# Altium project Khach.PrjPcb
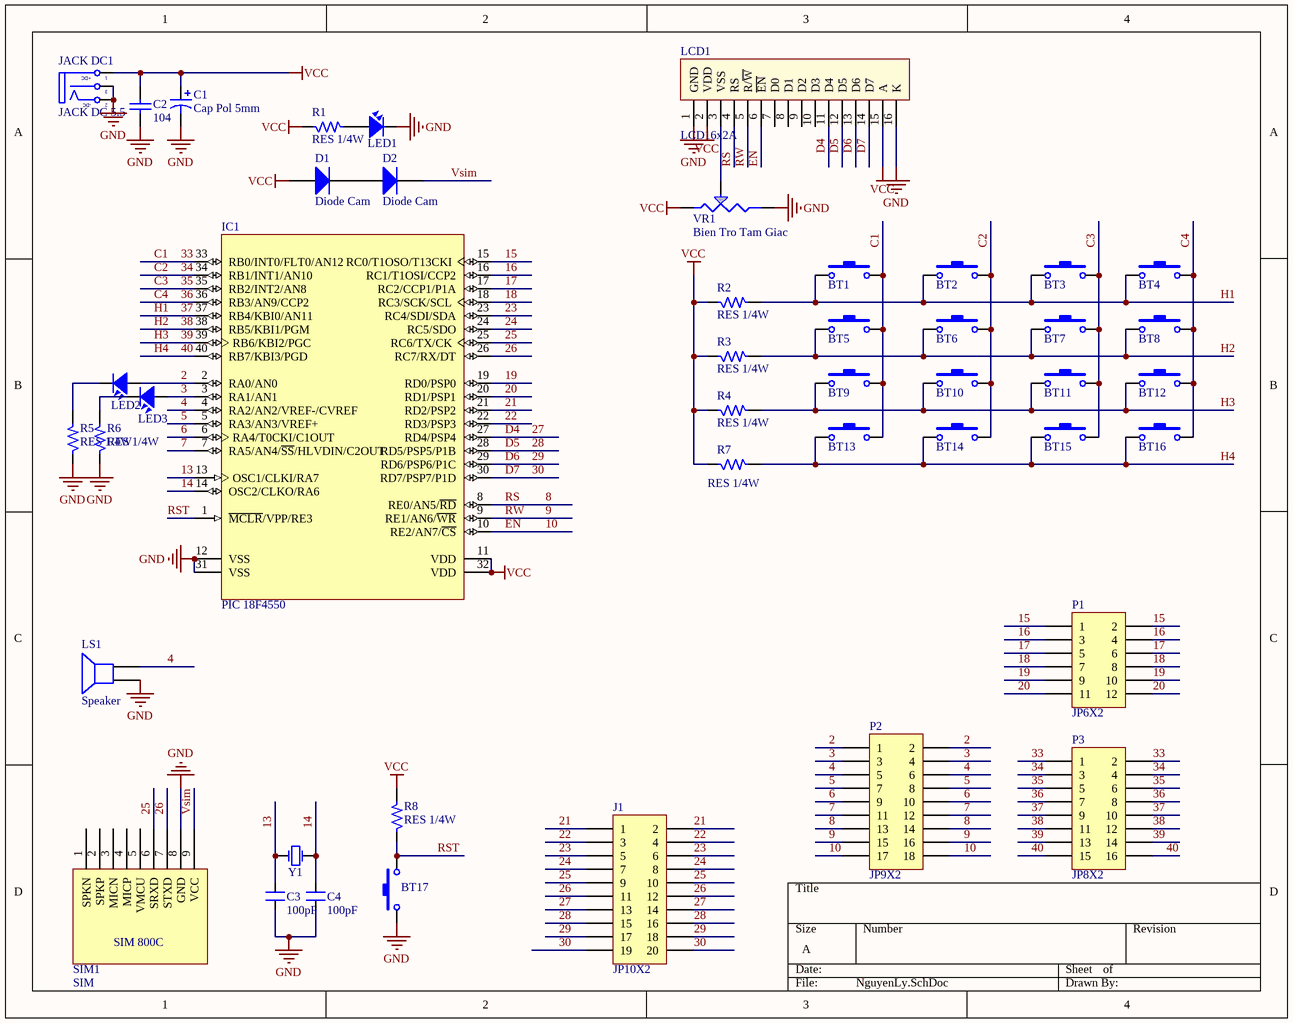
[diagram p0: NguyenLy.SchDoc]
1 sheet, 45 parts. Net scope: global (net labels, ports and power ports of the same name join across sheets).
Board file: PCB.PcbDoc

## Sheet NguyenLy.SchDoc
size A

### Parts
BT1  Nut Nhan 2 Chan  [Nut Nhan 2 Chan]  (value not drawn)
BT2  Nut Nhan 2 Chan  [Nut Nhan 2 Chan]  (value not drawn)
BT3  Nut Nhan 2 Chan  [Nut Nhan 2 Chan]  (value not drawn)
BT4  Nut Nhan 2 Chan  [Nut Nhan 2 Chan]  (value not drawn)
BT5  Nut Nhan 2 Chan  [Nut Nhan 2 Chan]  (value not drawn)
BT6  Nut Nhan 2 Chan  [Nut Nhan 2 Chan]  (value not drawn)
BT7  Nut Nhan 2 Chan  [Nut Nhan 2 Chan]  (value not drawn)
BT8  Nut Nhan 2 Chan  [Nut Nhan 2 Chan]  (value not drawn)
BT9  Nut Nhan 2 Chan  [Nut Nhan 2 Chan]  (value not drawn)
BT10  Nut Nhan 2 Chan  [Nut Nhan 2 Chan]  (value not drawn)
BT11  Nut Nhan 2 Chan  [Nut Nhan 2 Chan]  (value not drawn)
BT12  Nut Nhan 2 Chan  [Nut Nhan 2 Chan]  (value not drawn)
BT13  Nut Nhan 2 Chan  [Nut Nhan 2 Chan]  (value not drawn)
BT14  Nut Nhan 2 Chan  [Nut Nhan 2 Chan]  (value not drawn)
BT15  Nut Nhan 2 Chan  [Nut Nhan 2 Chan]  (value not drawn)
BT16  Nut Nhan 2 Chan  [Nut Nhan 2 Chan]  (value not drawn)
BT17  Nut Nhan 2 Chan  [Nut Nhan 2 Chan]  (value not drawn)
C1  Cap Pol 5mm  [C5mm]
C2  104  [Tu-ceramic]
C3  100pF  [CN1]
C4  100pF  [CN1]
D1  Diode Cam  [Diode Cam]
D2  Diode Cam  [Diode Cam]
IC1  PIC 18F4550  [DIP40/W0.6]
J1  JP10X2  [HDR2X10]
JACK_DC1  JACK DC 5.5  [JACK DC 5.5]
LCD1  LCD16x2A  [LCD16X2]
LED1  LED  [LED-3MM-YELLOW]  (value not drawn)
LED2  LED  [LED-3MM-YELLOW]  (value not drawn)
LED3  LED  [LED-3MM-YELLOW]  (value not drawn)
LS1  Speaker  [SPK]
P1  JP6X2  [HDR2X6]
P2  JP9X2  [HDR2X9]
P3  JP8X2  [HDR2X8]
R1  RES 1/4W  [Tro 1/4W]
R2  RES 1/4W  [Tro 1/4W]
R3  RES 1/4W  [Tro 1/4W]
R4  RES 1/4W  [Tro 1/4W]
R5  RES 1/4W  [Tro 1/4W]
R6  RES 1/4W  [Tro 1/4W]
R7  RES 1/4W  [Tro 1/4W]
R8  RES 1/4W  [Tro 1/4W]
SIM1  SIM  [JUMP DON 9]
VR1  Bien Tro Tam Giac  [VR-TAM GIAC]
Y1  20MHz  [Thach anh 2 chan]  (value not drawn)

### Nets
GND: BT17.1 C1.2 C2.1 C3.2 C4.2 IC1.12(VSS) IC1.31(VSS) JACK_DC1.2(TN) JACK_DC1.3(S) LCD1.1(GND) LCD1.16(K) LED1.2 LS1.1 R5.1 R6.1 SIM1.8(GND) VR1.3(B)
VCC: C1.1 C2.2 D1.1(A) IC1.11(VDD) IC1.32(VDD) JACK_DC1.1(T) LCD1.2(VDD) LCD1.15(A) R1.1 R2.1 R3.1 R4.1 R7.1 R8.2 VR1.1(A)
2: IC1.2(RA0/AN0) LED2.1 P2.1 P2.2
3: IC1.3(RA1/AN1) LED3.1 P2.3 P2.4
4: IC1.4(RA2/AN2/VREF-/CVREF) LS1.2 P2.5 P2.6
5: IC1.5(RA3/AN3/VREF+) P2.7 P2.8
6: IC1.6(RA4/T0CKI/C1OUT) P2.9 P2.10
7: IC1.7(RA5/AN4/~{SS}/HLVDIN/C2OUT) P2.11 P2.12
8: IC1.8(RE0/AN5/~{RD}) LCD1.4(RS) P2.13 P2.14  [also labelled RS]
9: IC1.9(RE1/AN6/~{WR}) LCD1.5(R/~{W}) P2.15 P2.16  [also labelled RW]
10: IC1.10(RE2/AN7/~{CS}) LCD1.6(~{EN}) P2.17 P2.18  [also labelled EN]
13: C3.1 IC1.13(OSC1/CLKI/RA7) Y1.2(OSC2)
14: C4.1 IC1.14(OSC2/CLKO/RA6) Y1.1(OSC1)
15: IC1.15(RC0/T1OSO/T13CKI) P1.1 P1.2
16: IC1.16(RC1/T1OSI/CCP2) P1.3 P1.4
17: IC1.17(RC2/CCP1/P1A) P1.5 P1.6
18: IC1.18(RC3/SCK/SCL) P1.7 P1.8
19: IC1.19(RD0/PSP0) P1.9 P1.10
20: IC1.20(RD1/PSP1) P1.11 P1.12
21: IC1.21(RD2/PSP2) J1.1 J1.2
22: IC1.22(RD3/PSP3) J1.3 J1.4
23: IC1.23(RC4/SDI/SDA) J1.5 J1.6
24: IC1.24(RC5/SDO) J1.7 J1.8
25: IC1.25(RC6/TX/CK) J1.9 J1.10 SIM1.6(SRXD)
26: IC1.26(RC7/RX/DT) J1.11 J1.12 SIM1.7(STXD)
27: IC1.27(RD4/PSP4) J1.13 J1.14 LCD1.11(D4)  [also labelled D4]
28: IC1.28(RD5/PSP5/P1B) J1.15 J1.16 LCD1.12(D5)  [also labelled D5]
29: IC1.29(RD6/PSP6/P1C) J1.17 J1.18 LCD1.13(D6)  [also labelled D6]
30: IC1.30(RD7/PSP7/P1D) J1.19 J1.20 LCD1.14(D7)  [also labelled D7]
33: BT1.2 BT5.2 BT9.2 BT13.2 IC1.33(RB0/INT0/FLT0/AN12) P3.1 P3.2  [also labelled C1]
34: BT2.2 BT6.2 BT10.2 BT14.2 IC1.34(RB1/INT1/AN10) P3.3 P3.4  [also labelled C2]
35: BT3.2 BT7.2 BT11.2 BT15.2 IC1.35(RB2/INT2/AN8) P3.5 P3.6  [also labelled C3]
36: BT4.2 BT8.2 BT12.2 BT16.2 IC1.36(RB3/AN9/CCP2) P3.7 P3.8  [also labelled C4]
37: BT1.1 BT2.1 BT3.1 BT4.1 IC1.37(RB4/KBI0/AN11) P3.9 P3.10 R2.2  [also labelled H1]
38: BT5.1 BT6.1 BT7.1 BT8.1 IC1.38(RB5/KBI1/PGM) P3.11 P3.12 R3.2  [also labelled H2]
39: BT9.1 BT10.1 BT11.1 BT12.1 IC1.39(RB6/KBI2/PGC) P3.13 P3.14 R4.2  [also labelled H3]
40: BT13.1 BT14.1 BT15.1 BT16.1 IC1.40(RB7/KBI3/PGD) P3.15 P3.16 R7.2  [also labelled H4]
RST: BT17.2 IC1.1(~{MCLR}/VPP/RE3) R8.1
Vsim: D2.2(K) SIM1.9(VCC)
NetD1_2: D1.2(K) D2.1(A)
NetLCD1_3: LCD1.3(VSS) VR1.2(WIPER)
NetLED1_1: LED1.1 R1.2
NetLED2_2: LED2.2 R5.2
NetLED3_2: LED3.2 R6.2

Not connected (* = marked no-connect by the designer): LCD1 7(D0) 8(D1) 9(D2) 10(D3); SIM1 1(SPKN) 2(SPKP) 3(MICN) 4(MICP) 5(VMCU)

### Notes on the sheet
- (in symbol JACK DC 5.5) +DC; -DC
- (in symbol SIM800C) SIM 800C

### Library data of the parts
C1 = Cap Pol 5mm: Polarized Capacitor (Axial); Published: 8-Jun-2000; LatestRevisionDate: 17-Jul-2002; LatestRevisionNote: Re-released for DXP Platform.; PackageReference: POLAR0.8; Publisher: Altium Limited
C2 = CAP 104-TANTALUM
C3 C4 = CN1: Cap np  1pF - 472pF; Value: 100pF
IC1 = PIC 18F4520: 32KB Flash, 1536B RAM, 256B EFROM, 40-Pin PDIP; Value: DIP 40; Value: 18F4520; Copyright by: VanDungEvn
J1 = JUMP DOI-10P: JUMP DOI DUC THANG; LatestRevisionDate: 17-Jul-2002; LatestRevisionNote: Re-released for DXP Platform.; Publisher: Altium Limited
JACK_DC1 = JACK DC 5.5: Value: Jac DC
LCD1 = LCD16X2: JUMP DON CAI; Value: LCD16x2A
LED1-LED3 = LED: LED Single colour Green and Red; Value: LED 3 ly Single Colour
LS1 = Speaker: Loudspeaker; Published: 24-Mar-1999; LatestRevisionDate: 17-Jul-2002; LatestRevisionNote: Re-released for DXP Platform.; PackageReference: PIN2; Publisher: Altium Limited
P1 = JUMP DOI-6: JUMP DOI DUC THANG; LatestRevisionDate: 17-Jul-2002; LatestRevisionNote: Re-released for DXP Platform.; Publisher: Altium Limited
P2 = JUMP DOI-9P: JUMP DOI DUC THANG; LatestRevisionDate: 17-Jul-2002; LatestRevisionNote: Re-released for DXP Platform.; Publisher: Altium Limited
P3 = JUMP DOI-8P: JUMP DOI DUC THANG; LatestRevisionDate: 17-Jul-2002; LatestRevisionNote: Re-released for DXP Platform.; Publisher: Altium Limited
R1-R8 = RES 1/4W: Tro 1/4W; Value: R1/4W - 1K
SIM1 = SIM800C
VR1 = Bien Tro Tam Giac: Text Field1: 50; Text Field2: 20
Y1 = Thach Anh Cam: Published: 8-Jun-2000; LatestRevisionDate: 17-Jul-2002; LatestRevisionNote: Re-released for DXP Platform.; PackageReference: R38; Publisher: Altium Limited
BT1-BT17 = Nut Nhan 2 Chan: Published: 24-Mar-1999; LatestRevisionDate: 17-Jul-2002; LatestRevisionNote: Re-released for DXP Platform.; PackageReference: SPST-2; Publisher: Altium Limited
D1 D2 = Diode Cam: Published: 8-Jun-2000; LatestRevisionDate: 17-Jul-2002; LatestRevisionNote: Re-released for DXP Platform.; DatasheetDocument: 1998; PackageDocument: Aug-1999; PackageReference: DO-201AD; Publisher: Altium Limited; ComponentLink1Description: Manufacturer Link; ComponentLink1URL: http://www.fairchildsemi.com/; ComponentLink2Description: Datasheet; ComponentLink2URL: http://www.fairchildsemi.com/ds/1N%2F1N5400.pdf